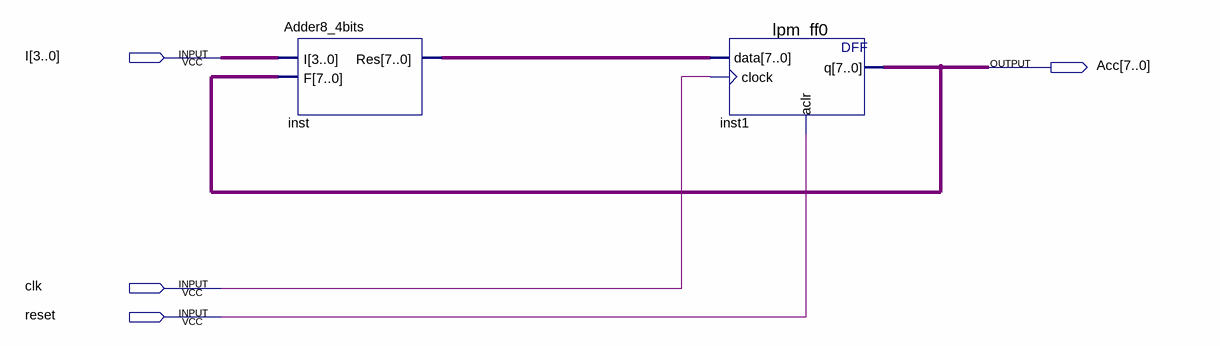
[diagram p0: schematic sheet]
// Quartus schematic Accumulator.bdf as structural Verilog: 2 symbols, 4 pins
module Accumulator (
  input  [3:0] I,
  input  clk,
  input  reset,
  output [7:0] Acc
);

  wire [7:0] inst_res;

  Adder8_4bits inst (.I(I), .F(Acc), .Res(inst_res));
  lpm_ff0 inst1 (.data(inst_res), .clock(clk), .aclr(reset), .q(Acc));
endmodule
